# EAGLE design Tasmodul_12V_Power_Manager (EAGLE 9.6.2)
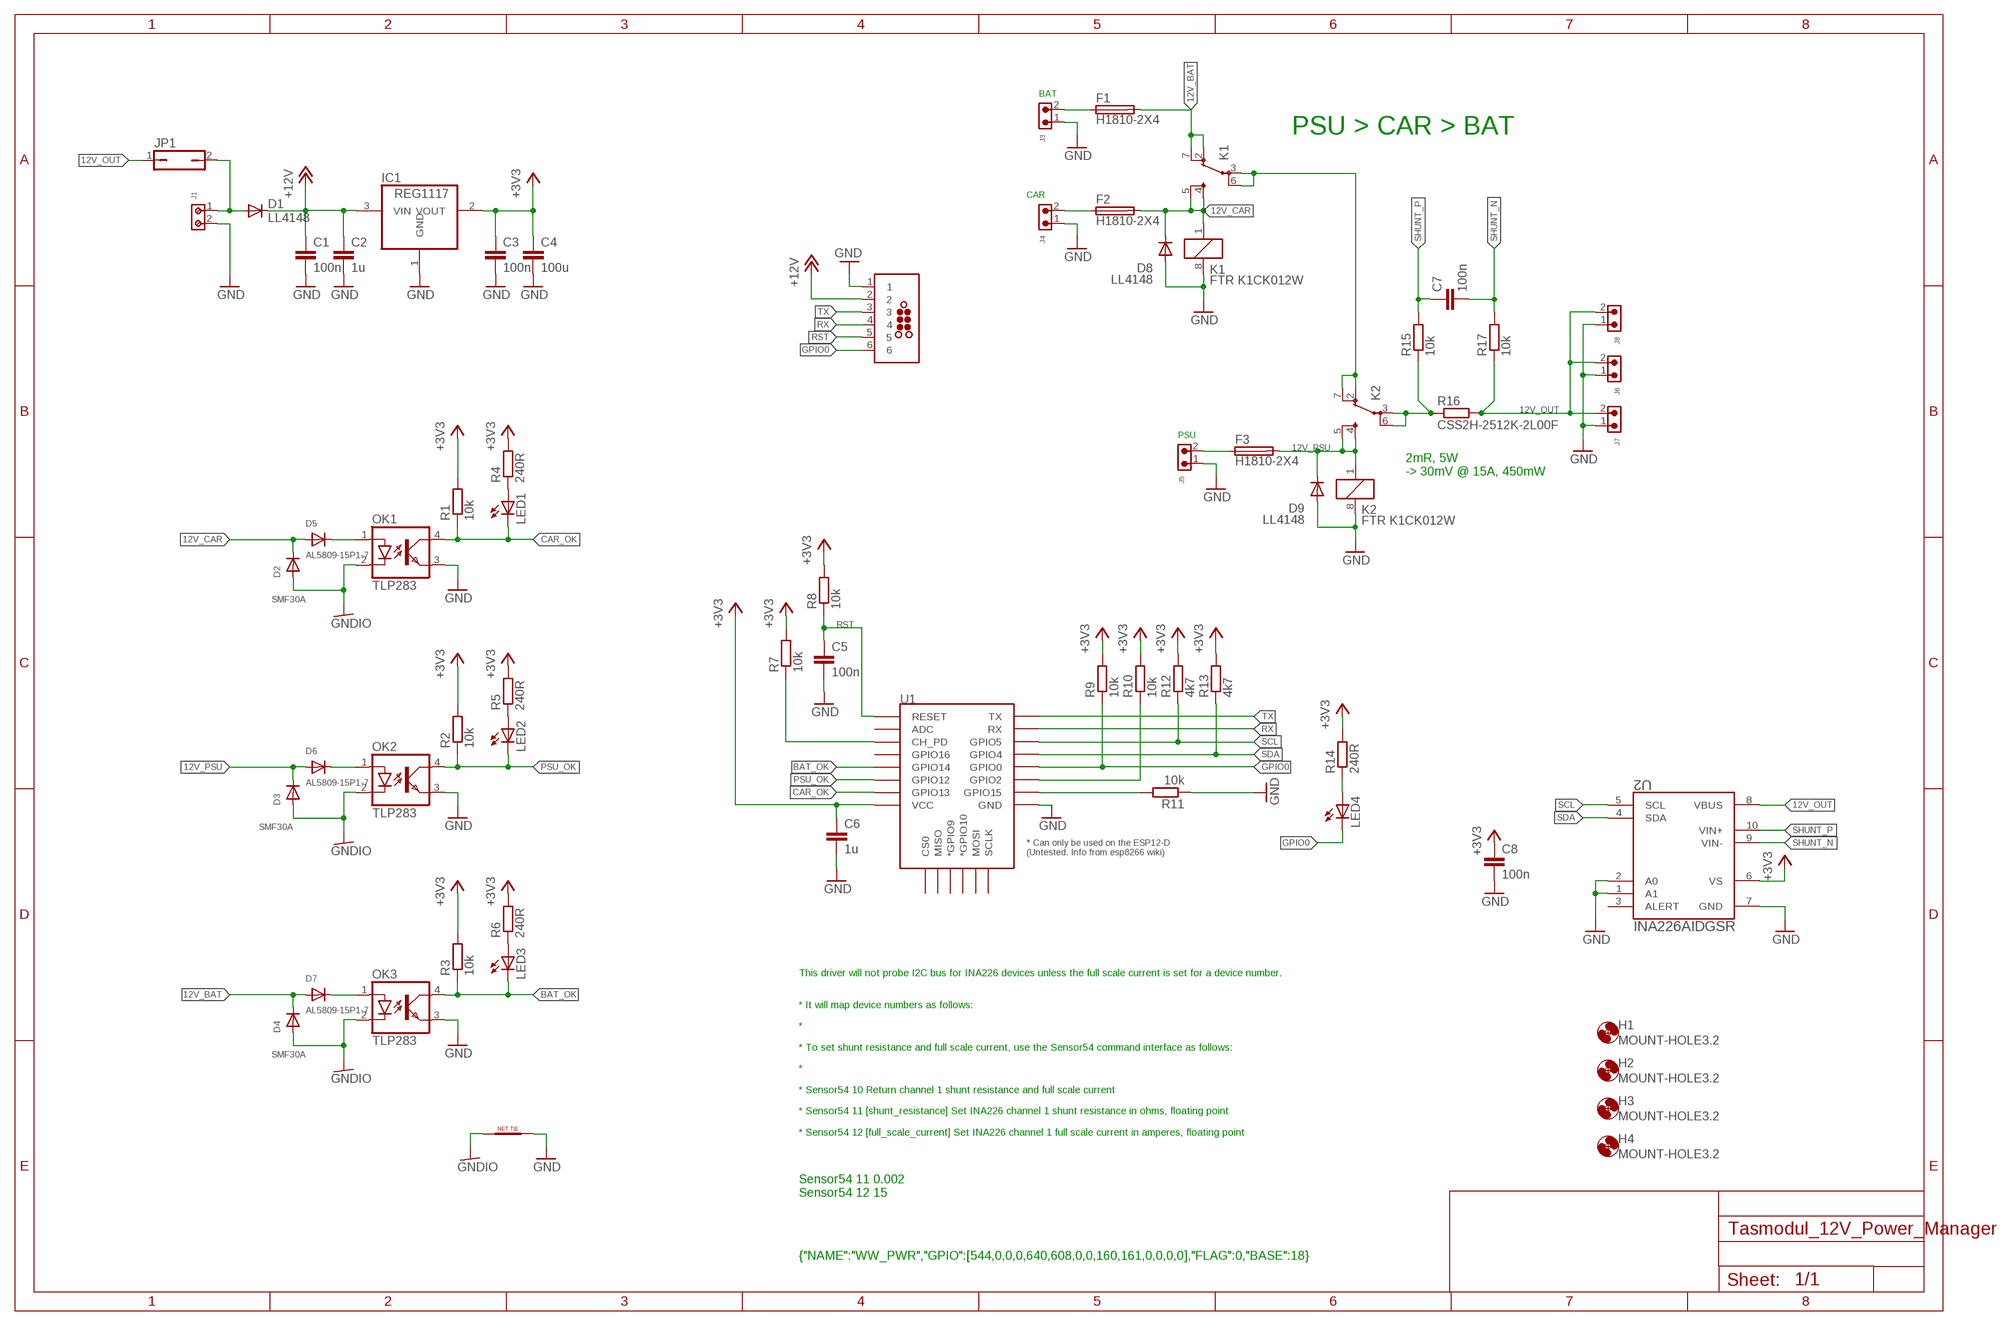
[diagram p0: schematic, sheet 1]

## Parts
C1  100n  C-EUC0603  [C0603]
C2  1u  C-EUC0603  [C0603]
C3  100n  C-EUC0603  [C0603]
C4  100u  C-EUC0603  [C0603]
C5  100n  C-EUC0603  [C0603]
C6  1u  C-EUC0603  [C0603]
C7  100n  C-EUC0603  [C0603]
C8  100n  C-EUC0603  [C0603]
D1  LL4148  DIODE-MINIMELF  [MINIMELF]
D2  SMF30A  DIODE_SOD-123FL  [SOD-123FL]
D3  SMF30A  DIODE_SOD-123FL  [SOD-123FL]
D4  SMF30A  DIODE_SOD-123FL  [SOD-123FL]
D5  AL5809-15P1-7  DIODE_SOD-123FL  [SOD-123FL]
D6  AL5809-15P1-7  DIODE_SOD-123FL  [SOD-123FL]
D7  AL5809-15P1-7  DIODE_SOD-123FL  [SOD-123FL]
D8  LL4148  DIODE-MINIMELF  [MINIMELF]
D9  LL4148  DIODE-MINIMELF  [MINIMELF]
F1  H1810-2X4  [H1810-2X4]
F2  H1810-2X4  [H1810-2X4]
F3  H1810-2X4  [H1810-2X4]
H1  MOUNT-HOLE3.2  [3,2]
H2  MOUNT-HOLE3.2  [3,2]
H3  MOUNT-HOLE3.2  [3,2]
H4  MOUNT-HOLE3.2  [3,2]
IC1  REG1117  [SOT223]
J1  691210910002  [691210910002]
J2  TC2030-MCP-NL  [TC2030-MCP-NL]
J3  691313510002  691313510002  [691313510002]
J4  691313510002  691313510002  [691313510002]
J5  691313510002  691313510002  [691313510002]
J6  691313510002  691313510002  [691313510002]
J7  691313510002  691313510002  [691313510002]
J8  691313510002  691313510002  [691313510002]
JP1  JP1Q  [JP1]
K1  FTR K1CK012W  FTR-K1C  [FTR-K1C]
K2  FTR K1CK012W  FTR-K1C  [FTR-K1C]
LED1  LEDCHIP-LED0603  [CHIP-LED0603]
LED2  LEDCHIP-LED0603  [CHIP-LED0603]
LED3  LEDCHIP-LED0603  [CHIP-LED0603]
LED4  LEDCHIP-LED0603  [CHIP-LED0603]
NT1  NET_TIE0.5MM  [NET_TIE_0.5]
OK1  TLP283  [MINI-FLAT-4]
OK2  TLP283  [MINI-FLAT-4]
OK3  TLP283  [MINI-FLAT-4]
R1  10k  R-EU_R0603  [R0603]
R2  10k  R-EU_R0603  [R0603]
R3  10k  R-EU_R0603  [R0603]
R4  240R  R-EU_R0603  [R0603]
R5  240R  R-EU_R0603  [R0603]
R6  240R  R-EU_R0603  [R0603]
R7  10k  R-EU_R0603  [R0603]
R8  10k  R-EU_R0603  [R0603]
R9  10k  R-EU_R0603  [R0603]
R10  10k  R-EU_R0603  [R0603]
R11  10k  R-EU_R0603  [R0603]
R12  4k7  R-EU_R0603  [R0603]
R13  4k7  R-EU_R0603  [R0603]
R14  240R  R-EU_R0603  [R0603]
R15  10k  R-EU_R0603  [R0603]
R16  CSS2H-2512K-2L00F  [CSS2H-2512K-2L00F]
R17  10k  R-EU_R0603  [R0603]
U1  ESP12ESMD  [ESP12E-SMD]
U2  INA226AIDGSR  [DGS10]

## Nets
12V_BAT: D4.C D7.A F1.B1 F1.B2 F1.B3 F1.B4 K1.2(-1:OA) K1.7(-1:OB)
12V_CAR: D2.C D5.A D8.C F2.B1 F2.B2 F2.B3 F2.B4 K1.1 K1.4(-1:SA) K1.5(-1:SB)
12V_OUT: J6.2 J7.2 J8.2 JP1.1 R16.2 R17.1 U2.8(VBUS)
12V_PSU: D3.C D6.A D9.C F3.B1 F3.B2 F3.B3 F3.B4 K2.1 K2.4(-1:SA) K2.5(-1:SB)
+3V3: C3.1 C4.1 C6.1 C8.1 IC1.2(VOUT) R1.2 R2.2 R3.2 R4.2 R5.2 R6.2 R7.2 R8.2 R9.2 R10.2 R12.2 R13.2 R14.2 U1.VCC U2.6(VS)
+12V: C1.1 C2.1 D1.C IC1.3(VIN) J2.2
BAT_OK: LED3.C OK3.4(COL) R3.1 U1.GPIO14
CAR_OK: LED1.C OK1.4(COL) R1.1 U1.GPIO13
GND: C1.2 C2.2 C3.2 C4.2 C5.2 C6.2 C8.2 D8.A D9.A IC1.1(GND) J1.2 J2.1 J3.1 J4.1 J5.1 J6.1 J7.1 J8.1 K1.8 K2.8 NT1.NET2 OK1.3(EMIT) OK2.3(EMIT) OK3.3(EMIT) R11.1 U1.GND U2.1(A1) U2.2(A0) U2.7(GND)
GNDIO: D2.A D3.A D4.A NT1.NET1 OK1.2(C) OK2.2(C) OK3.2(C)
GPIO0: J2.6 LED4.C R9.1 U1.GPIO0
N$1: LED1.A R4.1
N$2: F1.A1 F1.A2 F1.A3 F1.A4 J3.2
N$3: D1.A J1.1 JP1.2
N$4: LED2.A R5.1
N$5: F3.A1 F3.A2 F3.A3 F3.A4 J5.2
N$6: R7.1 U1.CH_PD
N$7: R11.2 U1.GPIO15
N$8: R10.1 U1.GPIO2
N$9: LED4.A R14.1
N$10: LED3.A R6.1
N$11: K2.3(-1:PA) K2.6(-1:PB) R15.1 R16.1
N$12: D5.C OK1.1(A)
N$13: K1.3(-1:PA) K1.6(-1:PB) K2.2(-1:OA) K2.7(-1:OB)
N$14: F2.A1 F2.A2 F2.A3 F2.A4 J4.2
N$16: D6.C OK2.1(A)
N$18: D7.C OK3.1(A)
PSU_OK: LED2.C OK2.4(COL) R2.1 U1.GPIO12
RST: C5.1 J2.5 R8.1 U1.RESET
RX: J2.4 U1.RXD0(RX)
SCL: R12.1 U1.GPIO5 U2.5(SCL)
SDA: R13.1 U1.GPIO4 U2.4(SDA)
SHUNT_N: C7.2 R17.2 U2.9(VIN-)
SHUNT_P: C7.1 R15.2 U2.10(VIN+)
TX: J2.3 U1.TXD0(TX)
Unconnected: U1.ADC U1.CS0 U1.GPIO9(*GPIO9) U1.GPIO10(*GPIO10) U1.GPIO16 U1.MISO U1.MOSI U1.SCLK U2.3(ALERT)

## Notes on the sheet
- BAT
- PSU > CAR > BAT
- CAR
- PSU
- 2mR, 5W
  -> 30mV @ 15A, 450mW
- This driver will not probe I2C bus for INA226 devices unless the full scale current is set for a device number.
  
  
  * It will map device numbers as follows:
  
  *
  
  * To set shunt resistance and full scale current, use the Sensor54 command interface as follows:
  
  *
  
  * Sensor54 10 Return channel 1 shunt resistance and full scale current
  
  * Sensor54 11 [shunt_resistance] Set INA226 channel 1 shunt resistance in ohms, floating point
  
  * Sensor54 12 [full_scale_current] Set INA226 channel 1 full scale current in amperes, floating point
- Sensor54 11 0.002
  Sensor54 12 15
- {"NAME":"WW_PWR","GPIO":[544,0,0,0,640,608,0,0,160,161,0,0,0,0],"FLAG":0,"BASE":18}

## Library data of the parts
C1-C8 = rcl:C-EU: CAPACITOR, European symbol
D1 D8 D9 = diode:DIODE-: DIODE
D2-D7 = adafruit:DIODE: Diode SMADIODE - SMA Surface Mount Package 20V 1A Schottky Diode Digikey: 641-1014-6-ND DO-1N4148 - Through Hole Small Current Diode SOD-123 20V 1 A (.5mV Vf) Schottky Diode - Digikey: MBRX120TPMSCT-ND SOD-323 10V 570mA (.38mV Vf, 3ns) Schottky Diode - Digikey: ZLLS410CT-ND SOD-523 30V 30mA Schottky Diode (RB751S-40TE61) - Digikey: RB751S-40TE61CT-ND SOT23-R/W - SOT23 Package (R = Solder Paste/Reflow Ovens, W = Hand-Soldering) BAT54Film 40V 300mA - Digikey: 497-7162-1-ND
F1-F3 = Eigene-Rietig:H1810-2X4
H1-H4 = holes:MOUNT-HOLE: MOUNTING HOLE with drill center marker
IC1 = burr-brown:REG1117: 800mA and 1A Low Dropout (LDO) Positive Regulator 1.8V, 2.5V, 2.85V, 3.3V, 5V, and Adj; MPN: REG1117; OC_FARNELL: 1097566; OC_NEWARK: 14P6981
J1 = Eagle_WR-TBL Rising Cage Clamp (rev20a):691210910002: WR-TBL Serie 2109 - 2.54 mm Horiz. Entry KIND PROPERTIES Pitch 2.54 mm MATERIAL PROPERTIES Insulator Material PA66 Insulator Flammability Rating UL94 V-0 Insulator Color Green Contact Material Brass Contact Plating Copper over Zinc Terminal Screw Material Steel Terminal Screw Plating Zinc Wire Guard Material Brass GENERAL INFORMATION Operating Temperature -40 up to +105 °C Compliance Lead free / RoHS ELECTRICAL PROPERTIES IR cULus 6 A Working Voltage [cULus] 150 V (AC) Withstanding Voltage [cULus] 1300 V (AC) Contact Resistance [cULus] 20 mΩ MECHANICAL PROPERTIES Wire Strip Length 4 up to 5 (mm) Screw M1.6 Solid Wire Section (AWG) 30 to 18 (AWG) Solid Wire Section (Metric) 0.0509 to 0.823 (mm²) Stranded Wire Section (AWG) 30 to 18 (AWG) Stranded Wire Section (Metric) 0.0509 to 0.823 (mm²) CERTIFICATION cULus Approval E315414 PACKAGING PROPERTIES Packaging Box <https://katalog.we-online.com/media/images/v2/o33231v209%20Family_WR-TBL_69121091000x.jpg> Details see: https://katalog.we-online.com/en/em/TBL_2_54_2109_HORIZONTAL_ENTRY_69121091000X Updated by Ella Wu 2019-11-12 2019(C) Wurth Elektronik; DATASHEET-URL: https://www.we-online.com/catalog/datasheet/691210910002.pdf; IR-UL: 6A; MOUNT: THT; PART-NUMBER: 691210910002; PINS: 2; PITCH: 2.54mm; TYPE: Horizontal; WIRE: 30 to 18 (AWG) 0.0509 to 0.823 (mm²); WORKING-VOLTAGE-UL: 150V (AC)
J2 = tag-connect:TC2030: TAG-CONNECT ICSP Connector Manufacturer: Tag-Connect <http://www.tag-connect.com> Cable for easy In-Circuit Serial Programming. Designed for Microchip ICD2, suitable for many others. Two variants - one "with legs" (for hands-free fit on PCB) and another "without legs" for quick programming. PAD Description 1 MCLR/Vpp 2 Vdd 3 GND 4 PGD (ISPDAT) 5 PGC (ISPCLK) 6 nc (used for LVP) ©2009 ROFA.cz - modified and updated by Robert Darlington ‹rdarlington@gmail.com›
J3-J8 = Wurth_Connectors_WR-TBL Pluggable Connector:691313510002: WR-TBL Serie 313 - 5.08 mm Close Horizontal PCB Header KIND PROPERTIES Pitch 5.08 mm MATERIAL PROPERTIES Insulator Material PA66 Insulator Flammability Rating UL94 V-0 Insulator Color Green Contact Material Brass Contact Plating Tin GENERAL INFORMATION Operating Temperature -40 up to +105 °C ELECTRICAL PROPERTIES IR cULus 20 A IR VDE 20 A Working Voltage [cULus] 300 V (AC) Working Voltage [VDE] 300 V (AC) Withstanding Voltage [cULus] 1600 V (AC) Withstanding Voltage [VDE] 2500 V (AC) Contact Resistance [cULus] 20 mΩ Contact Resistance [VDE] 20 mΩ CERTIFICATION cULus Approval E315414 VDE Approval 40023195 [Model number 313] <https://www.we-online.com/catalog/media/o33265v209%20Family_WR-TBL_6913135100xx.jpg> https://www.we-online.com/catalog/en/TBL_5_08_313_CLOSE_HORIZONTAL_PCB_HEADER_6913135100XX/ Updated by Ella Wu 2019-12-26 2019(C) Wurth Elektronik; DATASHEET-URL: https://www.we-online.com/catalog/datasheet/691313510002.pdf; IR-UL: 20A; IR-VDE: 20A; MOUNT: THT; PART-NUMBER: 691313510002; PINS: 2; PITCH: 5.08mm; TYPE: Horizontal; WORKING-VOLTAGE-UL: 300V (AC); WORKING-VOLTAGE-VDE: 300V (AC)
JP1 = jumper:JP1Q: JUMPER
K1 K2 = relay:FTR-K1C: NETZRELAIS FTR-K1CK024W1XUM 16A/250VAC 1 Umschaltkontakt Distributor: Conrad Electronic Bestell Nr.: 504389-13 - 24V Source: http://www.produktinfo.conrad.com/datenblaetter/500000-524999/504384-da-01-de-NETZRELAIS_FTR_K1CK012W1XUM_16A_250VAC.pdf; OC_FARNELL: unknown; OC_NEWARK: unknown
LED1-LED4 = led:LED: LED OSRAM: - CHIPLED LG R971, LG N971, LY N971, LG Q971, LY Q971, LO R971, LY R971 LH N974, LH R974 LS Q976, LO Q976, LY Q976 LO Q996 - Hyper CHIPLED LW Q18S LB Q993, LB Q99A, LB R99A - SideLED LS A670, LO A670, LY A670, LG A670, LP A670 LB A673, LV A673, LT A673, LW A673 LH A674 LY A675 LS A676, LA A676, LO A676, LY A676, LW A676 LS A679, LY A679, LG A679 - Hyper Micro SIDELED® LS Y876, LA Y876, LO Y876, LY Y876 LT Y87S - SmartLED LW L88C, LW L88S LB L89C, LB L89S, LG L890 LS L89K, LO L89K, LY L89K LS L896, LA L896, LO L896, LY L896 - TOPLED LS T670, LO T670, LY T670, LG T670, LP T670 LSG T670, LSP T670, LSY T670, LOP T670, LYG T670 LG T671, LOG T671, LSG T671 LB T673, LV T673, LT T673, LW T673 LH T674 LS T676, LA T676, LO T676, LY T676, LB T676, LH T676, LSB T676, LW T676 LB T67C, LV T67C, LT T67C, LS T67K, LO T67K, LY T67K, LW E67C LS E67B, LA E67B, LO E67B, LY E67B, LB E67C, LV E67C, LT E67C LW T67C LS T679, LY T679, LG T679 LS T770, LO T770, LY T770, LG T770, LP T770 LB T773, LV T773, LT T773, LW T773 LH T774 LS E675, LA E675, LY E675, LS T675 LS T776, LA T776, LO T776, LY T776, LB T776 LHGB T686 LT T68C, LB T68C - Hyper Mini TOPLED® LB M676 - Mini TOPLED Santana® LG M470 LS M47K, LO M47K, LY M47K Source: http://www.osram.convergy.de LUXEON: - LUMILED® LXK2-PW12-R00, LXK2-PW12-S00, LXK2-PW14-U00, LXK2-PW14-V00 LXK2-PM12-R00, LXK2-PM12-S00, LXK2-PM14-U00 LXK2-PE12-Q00, LXK2-PE12-R00, LXK2-PE12-S00, LXK2-PE14-T00, LXK2-PE14-U00 LXK2-PB12-K00, LXK2-PB12-L00, LXK2-PB12-M00, LXK2-PB14-N00, LXK2-PB14-P00, LXK2-PB14-Q00 LXK2-PR12-L00, LXK2-PR12-M00, LXK2-PR14-Q00, LXK2-PR14-R00 LXK2-PD12-Q00, LXK2-PD12-R00, LXK2-PD12-S00 LXK2-PH12-R00, LXK2-PH12-S00 LXK2-PL12-P00, LXK2-PL12-Q00, LXK2-PL12-R00 Source: www.luxeon.com KINGBRIGHT: KA-3528ASYC Source: www.kingbright.com
NT1 = Eigene-Rietig:NET_TIE
OK1-OK3 = optocoupler:TLP283: TOSHIBA PHOTOCOUPLER GaAs IRED & PHOTO-TRANSISTOR Source: http://www.semicon.toshiba.co.jp/td/en/Opto/Photocoupler/en_20050928_TLP283_datasheet.pdf; OC_FARNELL: unknown; OC_NEWARK: unknown
R1-R15 R17 = rcl:R-EU_: RESISTOR, European symbol
R16 = Eigene-Rietig:CSS2H-2512K-2L00F
U1 = esp8266modules:ESP12E: ESP12E Module
U2 = Eigene-Rietig:INA226AIDGSR; COPYRIGHT: Copyright (C) 2022 Ultra Librarian. All rights reserved.; MANUFACTURER_PART_NUMBER: INA226AIDGSR; MFR_NAME: Texas Instruments

## Board
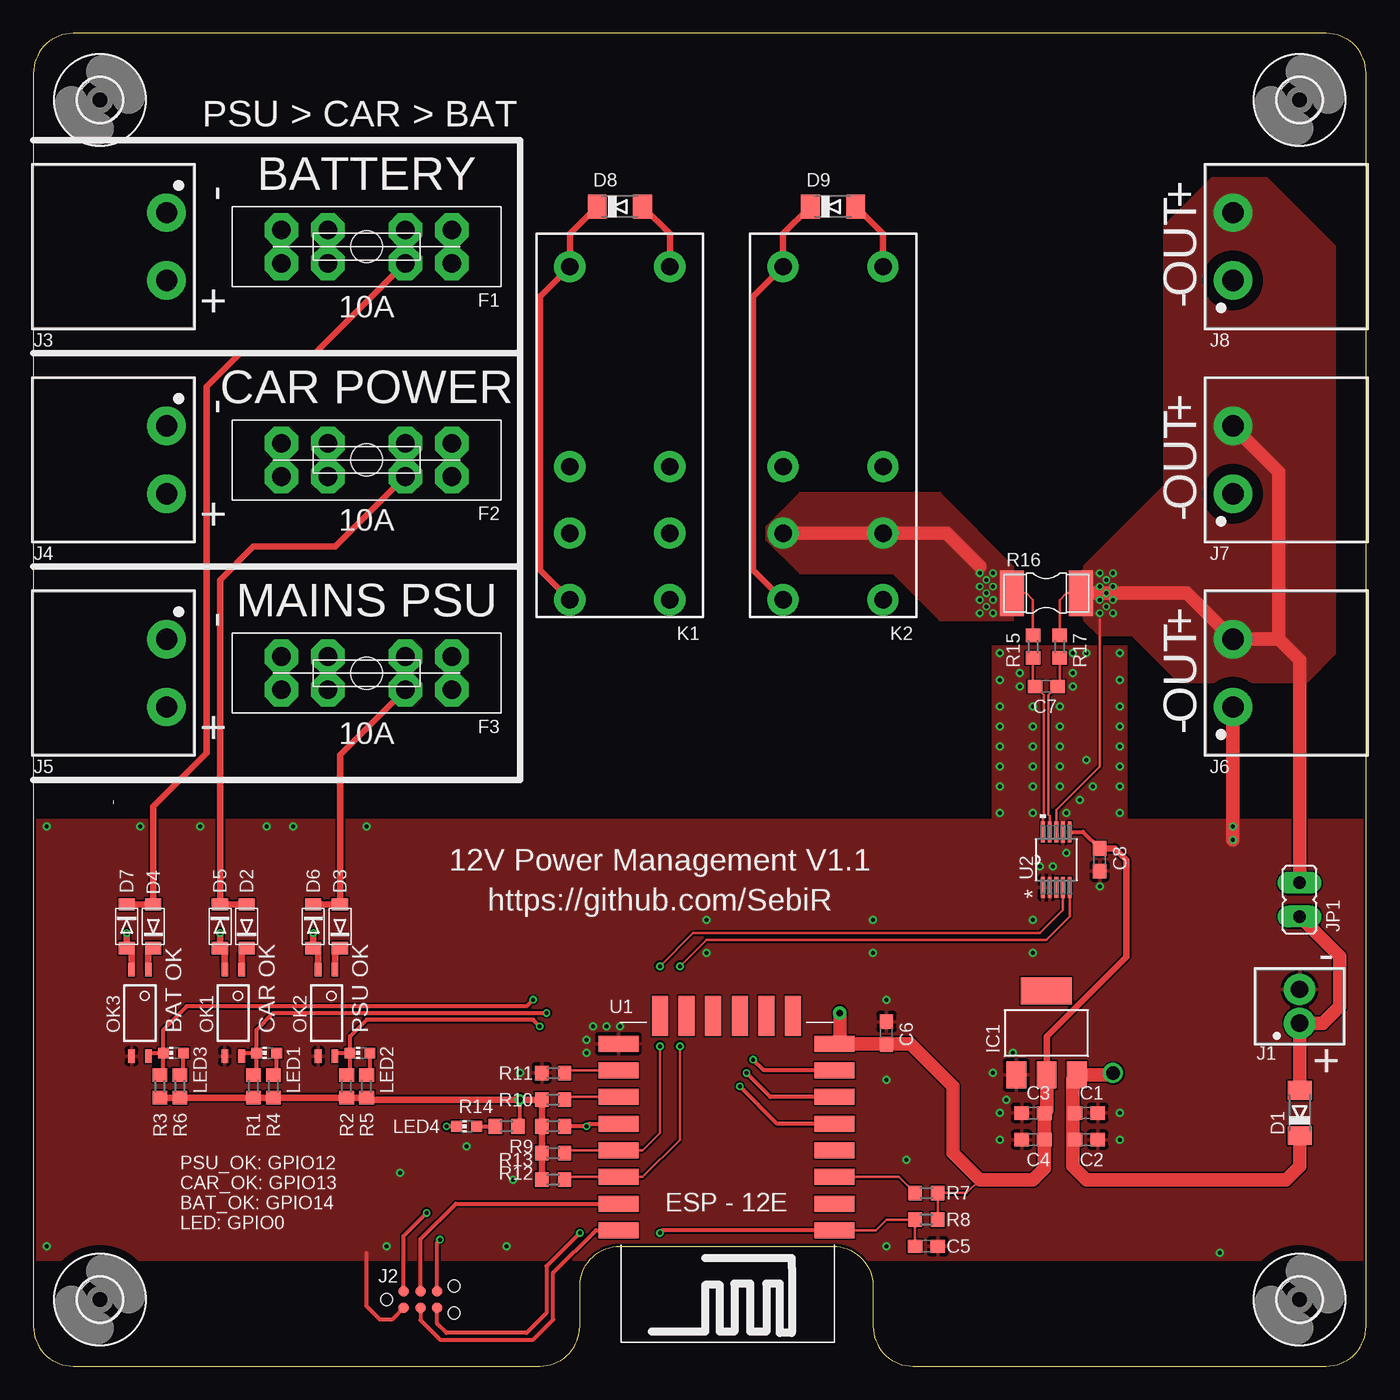
[diagram p1: board, top side]
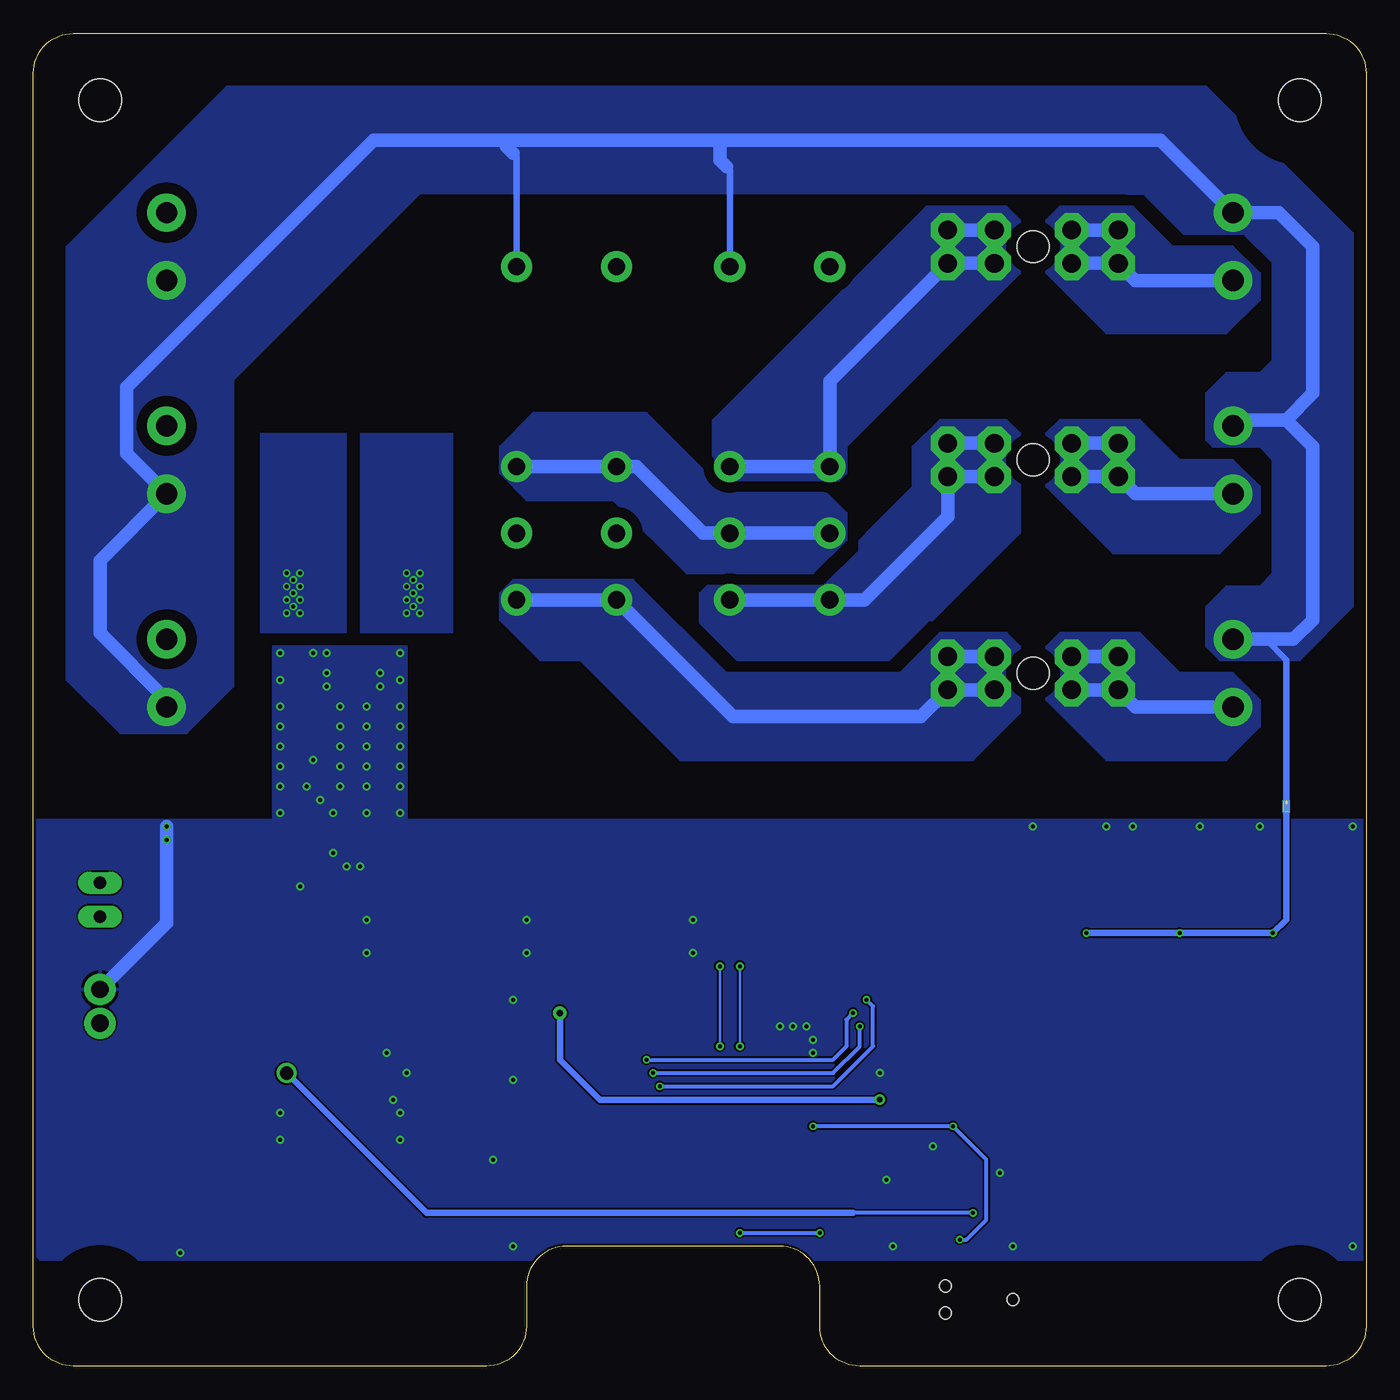
[diagram p2: board, bottom side, seen from below]

Size 100 x 100 mm. Coordinates in mm from the lower left corner, seen from the top.
Outline: 0,97 0,3 arc90 3,0 38,0 arc90 41,3 41,6 arc-90 44,9 60,9 arc-90 63,6 63,3 arc90 66,0 97,0 arc90 100,3 100,97 arc90 97,100 3,100 arc90 0,97
Copper layers (1*16): Top 0.035mm / dielectric 1.6mm / Bottom 0.035mm
Design rules "jlcpcb-2layers": minimum track width 0.2mm, minimum drill 0.3mm, track to track 5mil, track to pad 5mil, pad to pad 5mil, via to via 5mil, smd to smd 5mil, copper to edge 0.2mm, drill to drill 6mil, minimum pad ring 10mil, minimum via ring 0.125mm, stop-mask expansion 4mil, vias tented up to drill 0.5mm, thermal gap 10mil

### Footprints (pad centres in the part's own frame; a part is rotated, then mirrored left to right if it is on the bottom)
C0603 = smd 1.1 x 1: 1 -0.85,0; 2 0.85,0
MINIMELF = smd 1.4 x 1.8: A 1.7,0; C -1.7,0
SOD-123FL = smd 0.91 x 1.22: A 1.637,0; C -1.637,0
H1810-2X4 = drill 1.4 pad 2.2 octagon: A1 -2.9,1.25; A2 -6.4,1.25; A3 -2.9,-1.25; A4 -6.4,-1.25; B1 2.9,1.25; B2 6.4,1.25; B3 2.9,-1.25; B4 6.4,-1.25 | hole 2.4: 0,0
3,2 = hole 3.2: 0,0
SOT223 = smd 1.499 x 2.007: 1 -2.261,-3.15; 2 0.025,-3.15; 3 2.311,-3.15 | smd 3.81 x 2.007: 4 0,3.15
691210910002 = drill 1.3: 1 -1.27,0; 2 1.27,0
TC2030-MCP-NL = smd 0.787 x 0.787: 1 1.27,-0.635; 2 1.27,0.635; 3 2.54,-0.635; 4 2.54,0.635; 5 3.81,-0.635; 6 3.81,0.635 | hole 0.889: 0,0; 5.08,-1.016; 5.08,1.016
691313510002 = drill 1.6: 1 -2.54,0; 2 2.54,0
JP1 = drill 0.914 long: 1 0,-1.27; 2 0,1.27
FTR-K1C = drill 1.3 pad 1.93: 1 -12.5,-3.75; 2 2.5,-3.75; 3 7.5,-3.75; 4 12.5,-3.75; 5 12.5,3.75; 6 7.5,3.75; 7 2.5,3.75; 8 -12.5,3.75
CHIP-LED0603 = smd 0.8 x 0.8: A 0,-0.75; C 0,0.75
NET_TIE_0.5 = smd 0.5 x 0.5: NET1 -0.2,0; NET2 0.2,0
MINI-FLAT-4 = smd 1 x 0.5: 1 -3.24,0.635; 2 -3.24,-0.635; 3 3.24,-0.635; 4 3.24,0.635
R0603 = smd 1 x 1.1: 1 -0.85,0; 2 0.85,0
CSS2H-2512K-2L00F = smd 1.8 x 3.4: 1 -2.6,0; 2 2.6,0
ESP12E-SMD = smd 3 x 1.2: ADC -8.1,3.8; CH_PD -8.1,1.8; GND 8.1,-8.2; GPIO0 8.1,-2.2; GPIO2 8.1,-4.2; GPIO4 8.1,-0.2; GPIO5 8.1,1.8; GPIO12 -8.1,-4.2; GPIO13 -8.1,-6.2; GPIO14 -8.1,-2.2; GPIO15 8.1,-6.2; GPIO16 -8.1,-0.2; RESET -8.1,5.8; RXD0 8.1,3.8; TXD0 8.1,5.8; VCC -8.1,-8.2 | smd 1.2 x 3: CS0 -5,-10.3; GPIO9 -1,-10.3; GPIO10 1,-10.3; MISO -3,-10.3; MOSI 3,-10.3; SCLK 5,-10.3
DGS10 = smd 1.575 x 0.279: 1 -2.095,1; 2 -2.095,0.5; 3 -2.095,0; 4 -2.095,-0.5; 5 -2.095,-1; 6 2.095,-1; 7 2.095,-0.5; 8 2.095,0; 9 2.095,0.5; 10 2.095,1

### Placement (x,y rotation side)
C1  79,19 0 top
C2  79,17 0 top
C3  75,19 180 top
C4  75,17 180 top
C5  67,9 0 top
C6  64,25 90 top
C7  76,51 0 top
C8  80,38 270 top
D1  95,19 90 top
D2  14,33 270 top
D3  21,33 270 top
D4  7,33 270 top
D5  16,33 90 top
D6  23,33 90 top
D7  9,33 90 top
D8  44,87 0 top
D9  60,87 0 top
F1  25,84 0 top
F2  25,68 0 top
F3  25,52 0 top
H1  5,5 0 top
H2  95,5 0 top
H3  95,95 0 top
H4  5,95 0 top
IC1  76,25 0 top
J1  95,27 90 top
J2  26.5,5 0 top
J3  10,84 270 top
J4  10,68 270 top
J5  10,52 270 top
J6  90,52 90 top
J7  90,68 90 top
J8  90,84 90 top
JP1  95,35 180 top
K1  44,70 270 top
K2  60,70 270 top
LED1  17.5,23.5 90 top
LED2  24.5,23.5 90 top
LED3  10.5,23.5 90 top
LED4  32.5,18 90 top
NT1  6,42 90 bottom
OK1  15,26.5 270 top
OK2  22,26.5 270 top
OK3  8,26.5 270 top
R1  16.5,21 270 top
R2  23.5,21 270 top
R3  9.5,21 270 top
R4  18,21 270 top
R5  25,21 270 top
R6  11,21 270 top
R7  67,13 0 top
R8  67,11 0 top
R9  39,18 180 top
R10  39,20 180 top
R11  39,22 0 top
R12  39,14 180 top
R13  39,16 180 top
R14  35.5,18 0 top
R15  75,54 270 top
R16  76,58 0 top
R17  77,54 270 top
U1  52,16 180 top
U2  76.75,38 90 top

### Tracks (layer width: path | path; a pad name or v marks a point on that pad's centre or on a via)
12V_BAT
  Top 0.5: F1.B3 21.15,76 15.5,76 13,73.5 13,46 9,42 D7.A D4.C
  Bottom 1: F1.B4 40.25,73.9 K1.2 K1.7 | F1.B4 F1.B2 F1.B1 F1.B3 F1.B4
  pour Bottom (isolate 0.8, rank 2, no thermals): 26,82 39,69 39,67 40,66 48,66 49,67 49,71 33,87 27,87 26,86
12V_CAR
  Top 0.5: K1.4 38,59.75 38,80.25 K1.1 40.25,84.95 D8.C | F2.B3 22.65,61.5 16.5,61.5 14,59 D2.C D5.A
  Bottom 1: K1.5 K1.4 37.65,57.5 31.4,63.75 F2.B4 | F2.B4 F2.B2 F2.B1 F2.B3 F2.B4
  pour Bottom (isolate 0.8, rank 2, no thermals): 32,71 27,71 26,70 26,62.5 35.5,53 48,53 50,55 50,58 49,59 41,59 34,66 34,69
12V_OUT  (via drill 0.3)
  Top 0.2: R17.1 77,57.5 77.5,58 R16.2 | U2.8 76.75,41.75 80,45 80,56
  Top 1: JP1.1 95,53 93.46,54.54 | 93.46,54.54 J6.2 86.54,58 R16.2 | J7.2 93.46,67.08 93.46,54.54
  other vias: 80,59.5 80,58.5 80,57.5 80,56.5 80.5,59 81,59.5 81,58.5 80.5,58 81,57.5 80.5,57 81,56.5
  pour Top (no thermals): 78.5,59.5 79.5,60.5 81,60.5 81.5,60 81.5,56 79,56 78.5,56.5
  pour Top (isolate 0.8, no thermals): 80,55 82.5,55 86,51.5 95.5,51.5 97.5,53.5 97.5,84 92.5,89 88.5,89 85,85.5 85,66 79,60 79,56
  pour Bottom: 76.5,70 76.5,55 83,55 83,70
12V_PSU
  Top 0.5: K2.4 54,59.75 54,80.25 K2.1 56.25,84.95 D9.C | D3.C D6.A 23,45.85 F3.B3
  Bottom 0.3: 28,50.65 F3.B3
  Bottom 1: F3.B4 33.4,48.75 47.5,48.75 K2.4 K2.5 | F3.B4 F3.B2 F3.B1 F3.B3 F3.B4
  pour Bottom (isolate 0.8, no thermals): 27,55 26,54 26,49 29.5,45.5 51.5,45.5 59,53 62,53 65,56 65,58 64,59 55,59 48,52 35,52 32,55
+3V3  (via drill 0.4 pad 0.8, 0.5 pad 1)
  Top 0.2: R8.2 R7.2 70,13 71,14
  Top 0.3: U2.6 78.75,40.1 C8.1 | R14.2 36.5,18.15 v36.5,20
  Top 0.5: R12.2 R13.2 R9.2 R10.2 v36.5,20 25.15,20 R5.2 R2.2 R4.2 R1.2 R6.2 R3.2 | C8.1 81.15,38.85 82,38 82,30.71 76.03,24.73 IC1.2
  Top 1: IC1.2 76.03,19.18 C3.1 C4.1 75.85,14.85 75,14 71,14 69,16 69,21 65.8,24.2 64,24.2 | 64,24.2 U1.VCC 60.5,24.4 v60.5,26.5 | C6.1 64,24.2
  Bottom 0.5: v60.5,26.5 60.5,23 57.5,20 v36.5,20
+12V  (via drill 0.3, 1 pad 1.5)
  Top 0.3: J2.2 27.77,9.77 v29.5,11.5
  Top 1: D1.C 95,15 94,14 79,14 78,15 78,17 | 78,17 78,19 | 78,19 78,21.54 IC1.3 80.85,21.85 v81,22 | C1.1 78,19 | C2.1 78,17
  Bottom 0.3: v29.5,11.5 38.5,11.5
  Bottom 0.5: v81,22 70.5,11.5 38.5,11.5
BAT_OK  (via drill 0.3)
  Top 0.3: R3.1 9.75,22.1 LED3.C | OK3.4 8.88,23.5 LED3.C | LED3.C 9.75,25.25 11.5,27 37,27 v37.5,27.5 | U1.GPIO14 55.8,18.2 v53,21
  Bottom 0.3: v53,21 40,21 37,24 37,27 v37.5,27.5
CAR_OK  (via drill 0.3)
  Top 0.3: OK1.4 15.88,23.5 LED1.C | R1.1 16.75,22.1 LED1.C | LED1.C 16.75,25.25 18,26.5 v38.5,26.5 | U1.GPIO13 54.8,22.2 v54,23
  Bottom 0.3: v54,23 40,23 39,24 39,26 v38.5,26.5
GND  (via drill 0.3 pad 0.6)  (1 unrouted)
  Top 0.3: J2.1 26.91,3.5 26,3.5 25,4.5 25,8.5
  Top 0.5: K1.8 47.75,84.95 D8.A | K2.8 63.75,84.95 D9.A
  Top 1: J6.1 v90,39.5
  Bottom 0.5: K1.8 47.75,89.75 48,90 | K2.8 63.75,90.75 64,91 | J5.1 7.54,54.54 6,53 6,42.43
  Bottom 1: J6.1 90,50 95,55 95,60.46 J7.1 93,68.46 93,73.46 74.46,92 48.5,92 | 6,71 4,73 4,84 6.54,86.54 J3.1 15.46,92 48.5,92 | 6,71 4,69 4,56 5.46,54.54 J5.1 | 6,71 9.54,71 J4.1 | 48,90 48.5,90.5 48.5,92 | 64,91 64.5,91.5 64.5,92 | J1.2 90,33.27 v90,39.5 v90,40.5
  other vias: 1,9 1,40.5 89,8.5 81.5,19 81.5,17 72.5,19 72.5,17 73.5,23.5 72,22 73,20 44,25.5 41.5,24.5 41.5,23.5 42,25.5 43,25.5 77.5,41.5 76.5,37.5 75.5,37.5 77.5,38.5 80,36 75,41.5 36.5,22 36,14 35.5,9 64,9 27.5,14.5 32.5,16.5 64,21.5 65.5,15.5 72.5,41.5 81.5,41.5 81.5,53.5 72.5,53.5 74,51 78,51 78,53.5 79,53.5 78,52 77,49.5 75,49.5 75,48 77,48 77,46.5 75,46.5 75,45 75,43.5 77,43.5 77,45 72.5,43.5 72.5,45 72.5,46.5 72.5,48 72.5,49.5 72.5,51.5 81.5,51.5 81.5,49.5 81.5,48 81.5,46.5 81.5,45 81.5,43.5 74,52 79,45.5 64,27.5 79.5,43.5 78.5,42.5 12.5,40.5 17.5,40.5 19.5,40.5 25,40.5 8,40.5 50.5,31 75,31 75,33.5 50.5,33.5 63,33.5 63,31 26.5,9
  pour Top (rank 2): 0,41 100,41 100,8 0,8
  pour Bottom (rank 2): 0,41 100,41 100,8.5 99.5,8 0,8
  pour Top (no thermals): 72,54 72,41 82,41 82,54
  pour Bottom (isolate 0.8, no thermals): 72,54 82,54 82,41 72,41
  pour Bottom (isolate 0.8, rank 2, no thermals): 5,53 11,53 12,54 12,57 10.5,58.5 8,58.5 7,59.5 7,68 8,69 11.5,69 12,69.5 12,73 10.5,74.5 8,74.5 7,75.5 7,82 9.5,84.5 14.5,84.5 18,88 71,88 85,74 85,51 88.5,47.5 93.5,47.5 97.5,51.5 97.5,84 85.5,96 12,96 1,85 1,57
GNDIO  (via drill 0.3)
  Top 0.5: OK3.2 7.37,31 D4.A v7,32.5 | OK1.2 14.37,31 D2.A v14,32.5 | OK2.2 21.36,31 D3.A v21,32.5
  Bottom 0.5: NT1.NET1 6,33.5 v7,32.5 v14,32.5 v21,32.5
GPIO0  (via drill 0.3)
  Top 0.2: 40.05,18.2 R9.1
  Top 0.3: J2.6 30.31,9.31 v30.5,9.5 | R9.1 v41.5,18 41.7,18.2 U1.GPIO0 | LED4.C v31,18
  Bottom 0.3: v30.5,9.5 30,9.5 28.5,11 28.5,15.5 v31,18 v41.5,18
N$1
  Top 0.3: R4.1 18.25,22.1 LED1.A
N$2
  Bottom 1: J3.2 17.31,81.46 F1.A4 | F1.A4 F1.A2 F1.A1 F1.A3 F1.A4
  pour Bottom (isolate 0.8, no thermals): 8,80 10.5,77.5 19.5,77.5 24,82 24,86 23,87 17.5,87 14.5,84 10,84 8,82
N$3
  Top 1: D1.A J1.1 96.73,25.73 98,27 98,30.73 JP1.2
N$4
  Top 0.3: R5.1 25.25,22.1 LED2.A
N$5
  Bottom 1: J5.2 17.31,49.46 F3.A4 | F3.A4 F3.A2 F3.A1 F3.A3 F3.A4
  pour Bottom (isolate 0.8, no thermals): 10,52 8,50 8,48 10.5,45.5 19.5,45.5 24,50 24,54 23,55 17,55 14,52
N$6
  Top 0.2: U1.CH_PD 64.95,14.2 R7.1
N$7
  Top 0.2: R11.2 40.05,22.2 U1.GPIO15
N$8
  Top 0.2: R10.1 40.05,20.2 U1.GPIO2
N$9
  Top 0.3: LED4.A R14.1
N$10
  Top 0.3: R6.1 11.25,22.1 LED3.A
N$11  (via drill 0.3)
  Top 0.2: R15.1 75,57.5 74.5,58 R16.1
  Top 1: K2.3 K2.6 68.5,62.5 71,60
  other vias: 72,59.5 72,58.5 72,57.5 72,56.5 71.5,59 71.5,58 71.5,57 71,59.5 71,58.5 71,57.5 71,56.5
  pour Top (no thermals): 70.5,60 71,60.5 72.5,60.5 74,59 74,57 73,56 70.5,56
  pour Top (no thermals): 55,63 55,62 57.5,59.5 64.5,59.5 68,56 73.5,56 73.5,60 68,65.5 57.5,65.5
  pour Bottom: 75.5,55 75.5,70 68.5,70 68.5,55
N$12
  Top 0.5: OK1.1 15.63,31 D5.C
N$13
  Bottom 1: K2.7 K2.2 54.75,67.5 49.75,62.5 K1.6 K1.3
  pour Bottom (isolate 0.8, no thermals): 40.5,65.5 39,64 39,62 41.5,59.5 51,59.5 56.5,65 63,65 65,67 65,69 62.5,71.5 54,71.5 48,65.5
N$14
  Bottom 1: J4.2 17.31,65.46 F2.A4 | F2.A4 F2.A2 F2.A1 F2.A3 F2.A4
  pour Bottom (isolate 0.8, no thermals): 10,68 8,66 8,64 11,61 19,61 24,66 24,70 23,71 17,71 14,68
N$16
  Top 0.5: OK2.1 22.64,31 D6.C
N$18
  Top 0.5: OK3.1 8.63,31 D7.C
PSU_OK  (via drill 0.3)
  Top 0.3: R2.1 23.75,22.1 LED2.C | OK2.4 22.88,23.5 LED2.C | LED2.C 23.75,24.75 25,26 37.5,26 v38,25.5 | U1.GPIO12 55.3,20.2 v53.5,22
  Bottom 0.3: v53.5,22 40,22 38,24 v38,25.5
RST  (via drill 0.3)
  Top 0.2: U1.RESET 63.2,10.2 64,11 R8.1 C5.1
  Top 0.3: U1.RESET 47.2,10.2 v47,10 | v41,10 38.5,7.5 38.5,4 37,2.5 31,2.5 30.31,3.19 J2.5
  Bottom 0.3: v47,10 v41,10
RX
  Top 0.3: J2.4 29.04,9.54 31.7,12.2 U1.RXD0
SCL  (via drill 0.3 pad 0.6)
  Top 0.2: R12.1 40.05,14.2 U1.GPIO5 45.7,14.2 48.5,17 v48.5,24 | U2.5 77.75,33.75 76,32 50.5,32 v48.5,30
  Bottom 0.2: v48.5,24 v48.5,30
SDA  (via drill 0.3 pad 0.6)
  Top 0.2: R13.1 40.05,16.2 U1.GPIO4 45.7,16.2 47,17.5 v47,24 | U2.4 77.25,34.25 75.5,32.5 49.5,32.5 v47,30
  Bottom 0.2: v47,24 v47,30
SHUNT_N
  Top 0.2: R17.2 77,51.15 C7.2 76.8,51 76.16,50.36 76.16,41.37 76.25,41.28 U2.9
SHUNT_P
  Top 0.2: R15.2 75,51.15 C7.1 75.2,51 75.84,50.36 75.84,41.37 75.75,41.28 U2.10
TX
  Top 0.3: J2.3 29.04,3.46 30.5,2 37.5,2 39,3.5 39,7 42.2,10.2 U1.TXD0

### Text on the board
tPlace: PSU > CAR > BAT | BATTERY | - | + | OUT | + | 10A | - | CAR POWER | - | + | OUT | + | 10A | - | MAINS PSU | - | + | OUT | + | 10A | - | 12V Power Management V1.1 | https://github.com/SebiR | - | BAT OK | CAR OK | PSU OK | + | PSU_OK: GPIO12 / CAR_OK: GPIO13 / BAT_OK: GPIO14 / LED: GPIO0